# Altium schematic sheet EVB-ANNA-B5_SCHEM_0004_Connectors_Memory.SchDoc
size A3; Date: 7/24/2020; CompanyName: U-blox; DrawnBy: EMOO; Engineer: EMOO; Organization: U-blox; Address1: 3950 Fairview Industrial Dr SE #100*; Address2: Salem, OR 97302; DocumentNumber: 7; SheetNumber: 5; SheetTotal: 8; SheetSize: B; SheetTitle: Interface MCU
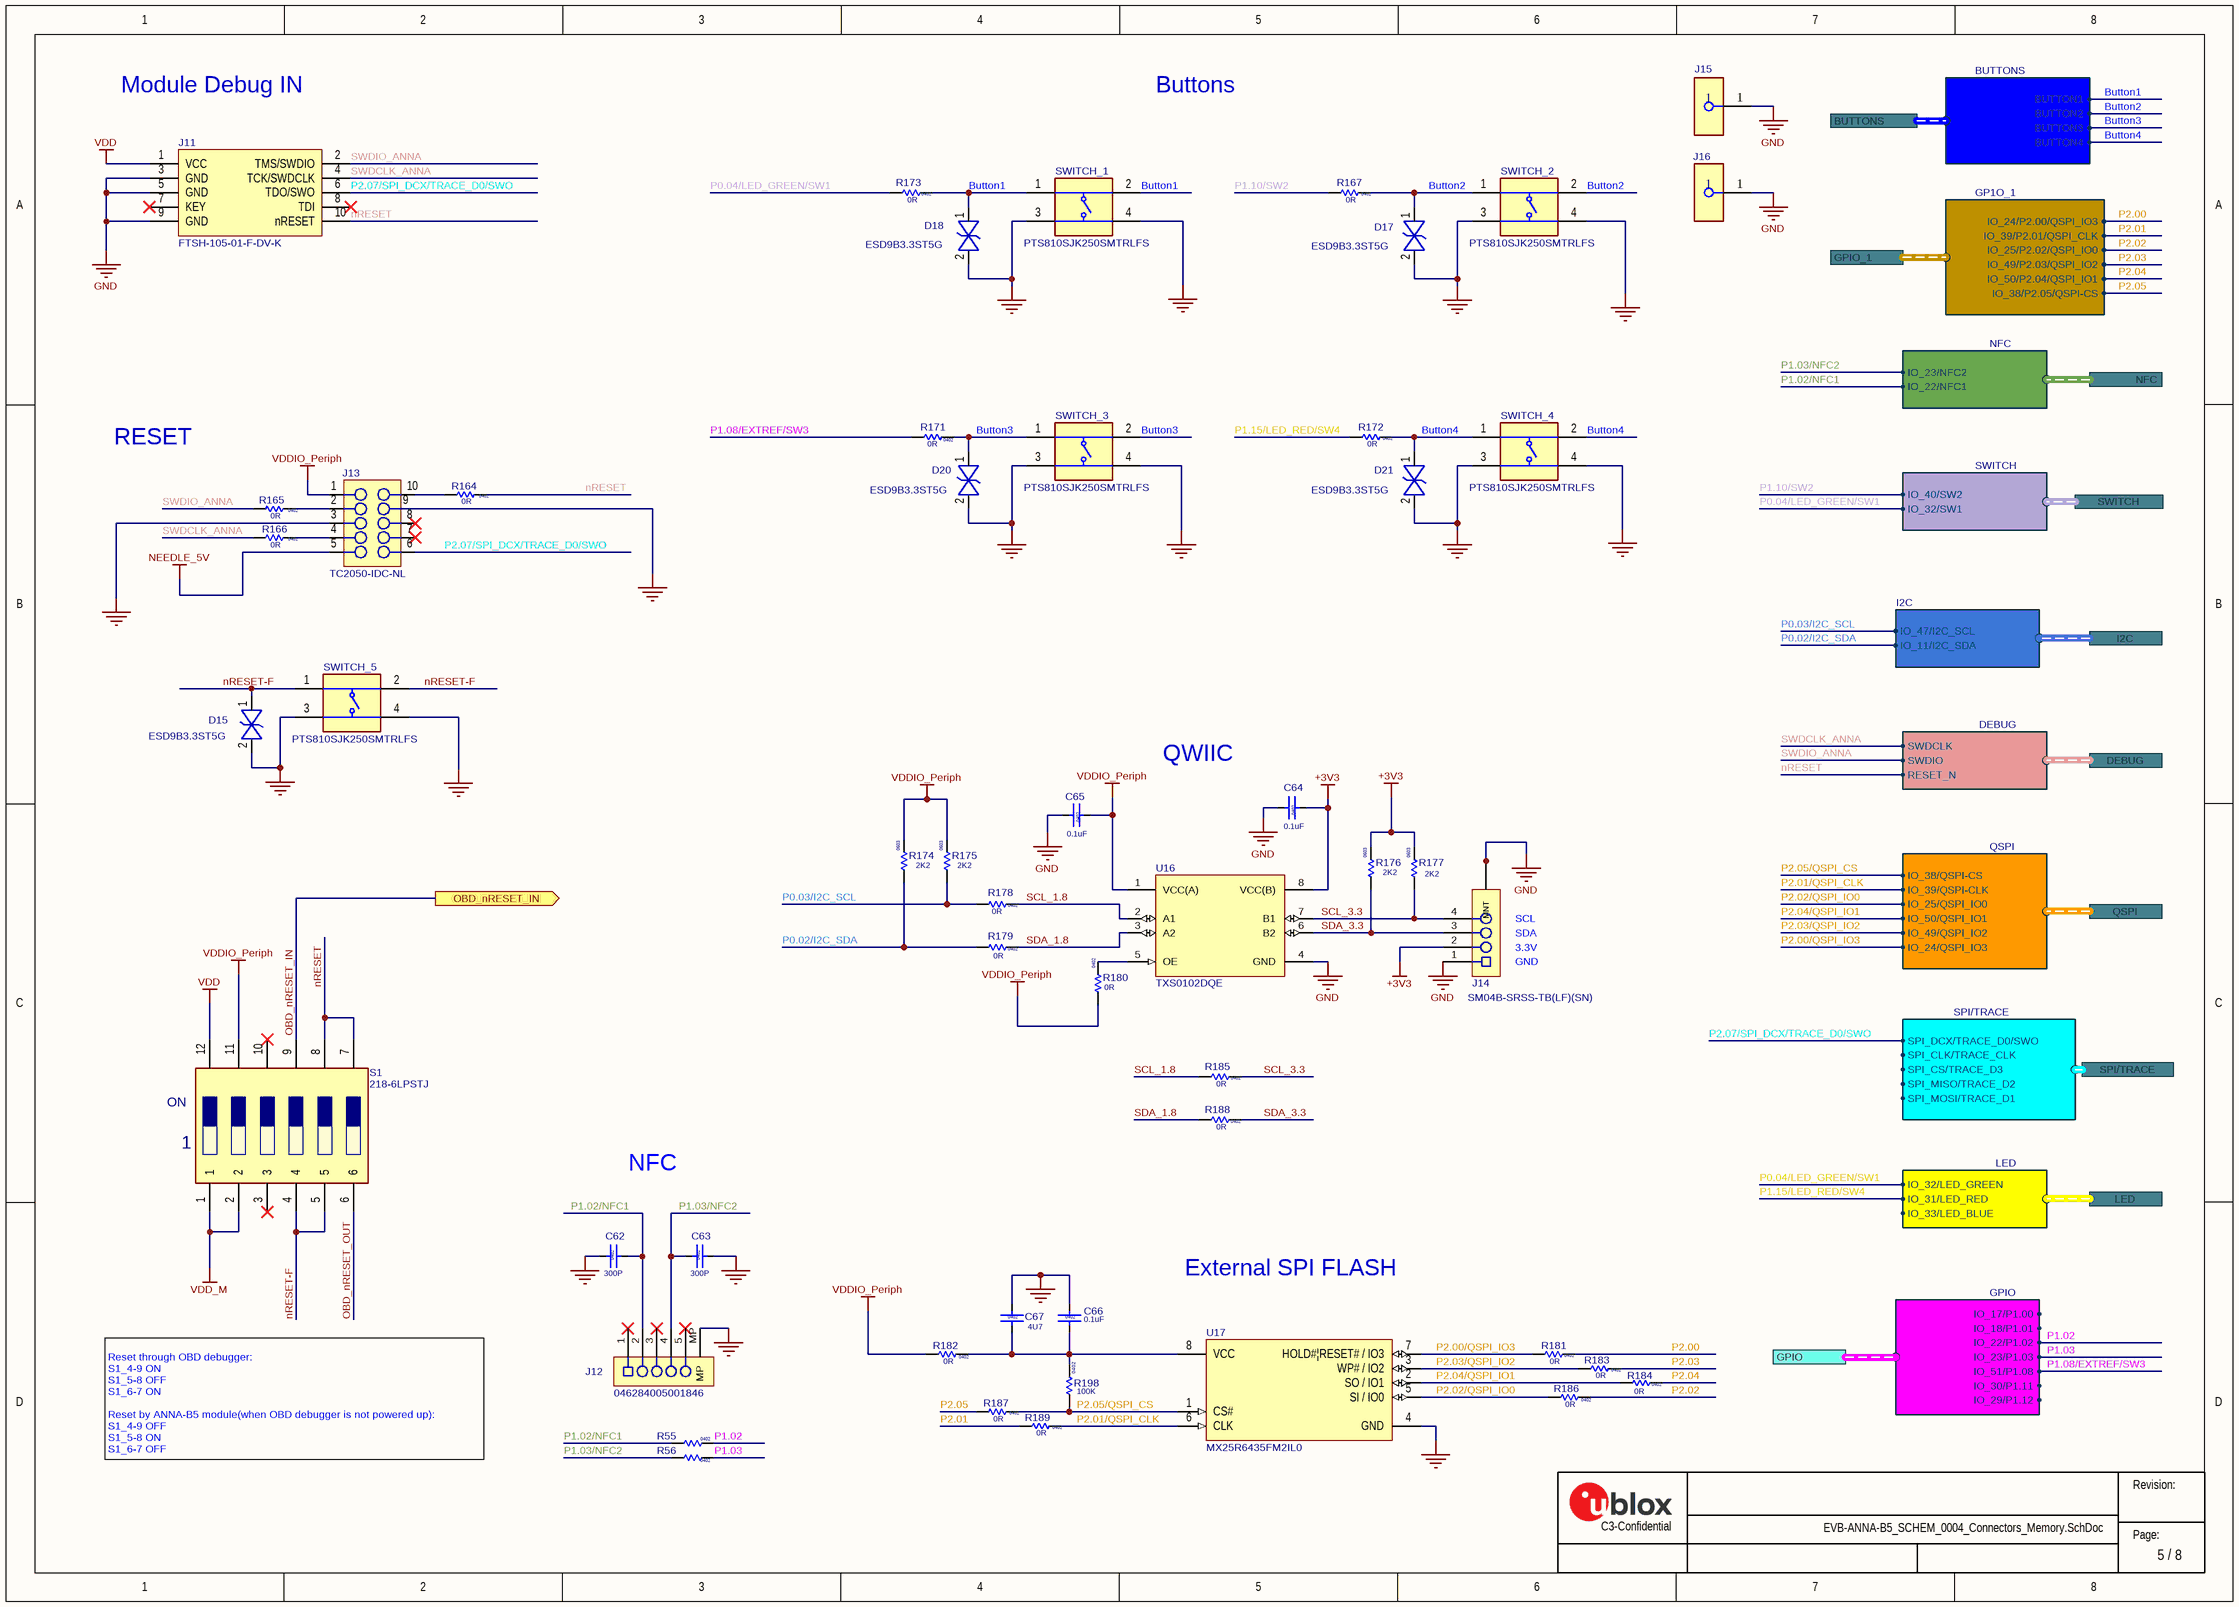
[diagram p0: EVB-ANNA-B5_SCHEM_0004_Connectors_Memory.SchDoc]

## Parts
C62  value 300P  Size: 0402  [Cap 0402 HD]  (hidden comment: UBXH01-0000594)
C63  value 300P  Size: 0402  [Cap 0402 HD]  (hidden comment: UBXH01-0000594)
C64  value 0.1uF  Size: 0402  [Cap 0402 HD]  (hidden comment: 120-00016)
C65  value 0.1uF  Size: 0402  [Cap 0402 HD]  (hidden comment: 120-00016)
C66  value 0.1uF  Size: 0402  [Cap 0402 HD]  (hidden comment: 120-00016)
C67  value 4U7  Size: 0402  [Cap 0402 HD]  (hidden comment: UBXH01-0000243)
D15  110-00019  [SOD-923]  (value not drawn)
D17  110-00019  [SOD-923]  (value not drawn)
D18  110-00019  [SOD-923]  (value not drawn)
D20  110-00019  [SOD-923]  (value not drawn)
D21  110-00019  [SOD-923]  (value not drawn)
J11  Manufacturer P/N: FTSH-105-01-F-DV-K  [HDR.050P-10Pin-2x5-SMT_Key]  (hidden comment: 130-00099)
J12  Manufacturer P/N: 046284005001846  [AVX/Kyocera - 046284005001846]  (hidden comment: UBXH04-0000798)
J13  TC2050-IDC-NL  [TC2050-IDC-NL]  (no BOM)
J14  Manufacturer Part Number 1: SM04B-SRSS-TB(LF)(SN)  [SM04B-SRSS-TB]  (hidden comment: UBXH04-0000797)
J15  (no value)  [Harwin_0_MFG]
J16  (no value)  [Harwin_0_MFG]
R55  Size: 0402  [RES 0402 HD]  (hidden comment: UBXH18-0003002)
R56  Size: 0402  [RES 0402 HD]  (hidden comment: UBXH18-0003002)
R164  value 0R  Size: 0402  [RES 0402 HD]  (hidden comment: UBXH18-0003002)
R165  value 0R  Size: 0402  [RES 0402 HD]  (hidden comment: UBXH18-0003002)
R166  value 0R  Size: 0402  [RES 0402 HD]  (hidden comment: UBXH18-0003002)
R167  value 0R  Size: 0402  [RES 0402 HD]  (hidden comment: UBXH18-0003002)
R171  value 0R  Size: 0402  [RES 0402 HD]  (hidden comment: UBXH18-0003002)
R172  value 0R  Size: 0402  [RES 0402 HD]  (hidden comment: UBXH18-0003002)
R173  value 0R  Size: 0402  [RES 0402 HD]  (hidden comment: UBXH18-0003002)
R174  value 2K2  Size: 0603  [RES_0603_1700Lx950Wx600H_600x1000Pad_800G_FLX]  (hidden comment: UBXH18-0007081)
R175  value 2K2  Size: 0603  [RES_0603_1700Lx950Wx600H_600x1000Pad_800G_FLX]  (hidden comment: UBXH18-0007081)
R176  value 2K2  Size: 0603  [RES_0603_1700Lx950Wx600H_600x1000Pad_800G_FLX]  (hidden comment: UBXH18-0007081)
R177  value 2K2  Size: 0603  [RES_0603_1700Lx950Wx600H_600x1000Pad_800G_FLX]  (hidden comment: UBXH18-0007081)
R178  value 0R  Size: 0402  [RES 0402 HD]  (hidden comment: UBXH18-0003002)
R179  value 0R  Size: 0402  [RES 0402 HD]  (hidden comment: UBXH18-0003002)
R180  value 0R  Size: 0402  [RES 0402 HD]  (hidden comment: UBXH18-0003002)
R181  value 0R  Size: 0402  [RES 0402 HD]  (hidden comment: UBXH18-0003002)
R182  value 0R  Size: 0402  [RES 0402 HD]  (hidden comment: UBXH18-0003002)
R183  value 0R  Size: 0402  [RES 0402 HD]  (hidden comment: UBXH18-0003002)
R184  value 0R  Size: 0402  [RES 0402 HD]  (hidden comment: UBXH18-0003002)
R185  value 0R  Size: 0402  [RES 0402 HD]  (hidden comment: UBXH18-0003002)
R186  value 0R  Size: 0402  [RES 0402 HD]  (hidden comment: UBXH18-0003002)
R187  value 0R  Size: 0402  [RES 0402 HD]  (hidden comment: UBXH18-0003002)
R188  value 0R  Size: 0402  [RES 0402 HD]  (hidden comment: UBXH18-0003002)
R189  value 0R  Size: 0402  [RES 0402 HD]  (hidden comment: UBXH18-0003002)
R198  value 100K  Size: 0402  [RES 0402 HD]  (hidden comment: UBXH18-0000005)
S1  218-6LPSTJ  [2186LPSTJ]
SWITCH_1  (no value)  [PTS810SJG250SMTRLFS]
SWITCH_2  (no value)  [PTS810SJG250SMTRLFS]
SWITCH_3  (no value)  [PTS810SJG250SMTRLFS]
SWITCH_4  (no value)  [PTS810SJG250SMTRLFS]
SWITCH_5  (no value)  [PTS810SJG250SMTRLFS]
U16  value TXS0102DQE  [DQE0008A]  (hidden comment: UBXH10-0000108)
U17  Manufacturer P/N: MX25R6435FM2IL0  [SOIC-8]  (hidden comment: UBXH13-0000149)

## Ports
BUTTONS (harness BUTTONS), DEBUG (harness Debug), GPIO (harness GPIO), GPIO_1 (harness GP1O_1), I2C (harness I2C), LED (harness LED), NFC (harness NFC), OBD_nRESET_IN (out), QSPI (harness QSPI), SPI/TRACE (harness SPI/TRACE), SWITCH (harness SWITCH)

## Harnesses
DEBUG: RESET_N, SWDIO, SWDCLK
SWITCH: IO_40/SW2, IO_32/SW1
LED: IO_33/LED_BLUE, IO_31/LED_RED, IO_32/LED_GREEN
BUTTONS: BUTTON3, BUTTON2, BUTTON1, BUTTON4
GP1O_1: IO_24/P2.00/QSPI_IO3, IO_39/P2.01/QSPI_CLK, IO_25/P2.02/QSPI_IO0, IO_49/P2.03/QSPI_IO2, IO_50/P2.04/QSPI_IO1, IO_38/P2.05/QSPI-CS
NFC: IO_23/NFC2, IO_22/NFC1
GPIO: IO_17/P1.00, IO_18/P1.01, IO_22/P1.02, IO_51/P1.08, IO_23/P1.03, IO_30/P1.11, IO_29/P1.12
SPI/TRACE: SPI_DCX/TRACE_D0/SWO, SPI_CLK/TRACE_CLK, SPI_CS/TRACE_D3, SPI_MISO/TRACE_D2, SPI_MOSI/TRACE_D1
QSPI: IO_38/QSPI-CS, IO_39/QSPI-CLK, IO_25/QSPI_IO0, IO_50/QSPI_IO1, IO_49/QSPI_IO2, IO_24/QSPI_IO3
I2C: IO_47/I2C_SCL, IO_11/I2C_SDA

## Nets
+3V3: C64.1 J14.2 R176.2 R177.2 U16.8(VCC(B))
GND: C62.1 C63.2 C64.2 C65.2 C66.1 C67.1 D15.2 D17.2 D18.2 D20.2 D21.2 J11.3(GND) J11.5(GND) J11.9(GND) J12.MP J13.3 J13.9 J14.1 J14.M1(MNT) J14.M2(MNT) J15.1 J16.1 SWITCH_1.3 SWITCH_1.4 SWITCH_2.3 SWITCH_2.4 SWITCH_3.3 SWITCH_3.4 SWITCH_4.3 SWITCH_4.4 SWITCH_5.3 SWITCH_5.4 U16.4(GND) U17.4(GND)
NEEDLE_5V: J13.5
VDD: J11.1(VCC) S1.12
VDD_M: S1.1 S1.2
VDDIO_Periph: C65.1 J13.1 R174.2 R175.2 R180.2 R182.1 S1.11 U16.1(VCC(A))
Button1: D18.1 R173.1 SWITCH_1.1 SWITCH_1.2 ; port BUTTONS.BUTTON1
Button2: D17.1 R167.1 SWITCH_2.1 SWITCH_2.2 ; port BUTTONS.BUTTON2
Button3: D20.1 R171.1 SWITCH_3.1 SWITCH_3.2 ; port BUTTONS.BUTTON3
Button4: D21.1 R172.1 SWITCH_4.1 SWITCH_4.2 ; port BUTTONS.BUTTON4
nRESET: J11.10(nRESET) R164.1 S1.7 S1.8 ; port DEBUG.RESET_N
nRESET-F: D15.1 S1.4 S1.5 SWITCH_5.1 SWITCH_5.2
OBD_nRESET_IN: S1.9 ; port OBD_nRESET_IN
OBD_nRESET_OUT: S1.6
P0.02/I2C_SDA: R174.1 R179.2 ; port I2C.IO_11/I2C_SDA
P0.03/I2C_SCL: R175.1 R178.2 ; port I2C.IO_47/I2C_SCL
P0.04/LED_GREEN/SW1: R173.2 ; port SWITCH.IO_32/SW1, port LED.IO_32/LED_GREEN
P1.02: R55.1 ; port GPIO.IO_22/P1.02
P1.02/NFC1: C62.2 J12.2 R55.2 ; port NFC.IO_22/NFC1
P1.03: R56.1 ; port GPIO.IO_23/P1.03
P1.03/NFC2: C63.1 J12.4 R56.2 ; port NFC.IO_23/NFC2
P1.08/EXTREF/SW3: R171.2 ; port GPIO.IO_51/P1.08
P1.10/SW2: R167.2 ; port SWITCH.IO_40/SW2
P1.15/LED_RED/SW4: R172.2 ; port LED.IO_31/LED_RED
P2.00: R181.1 ; port GPIO_1.IO_24/P2.00/QSPI_IO3
P2.00/QSPI_IO3: R181.2 U17.7(HOLD#|RESET#_/_IO3) ; port QSPI.IO_24/QSPI_IO3
P2.01: R189.2 ; port GPIO_1.IO_39/P2.01/QSPI_CLK
P2.01/QSPI_CLK: R189.1 U17.6(CLK) ; port QSPI.IO_39/QSPI-CLK
P2.02: R186.1 ; port GPIO_1.IO_25/P2.02/QSPI_IO0
P2.02/QSPI_IO0: R186.2 U17.5(SI_/_IO0) ; port QSPI.IO_25/QSPI_IO0
P2.03: R183.1 ; port GPIO_1.IO_49/P2.03/QSPI_IO2
P2.03/QSPI_IO2: R183.2 U17.3(WP#_/_IO2) ; port QSPI.IO_49/QSPI_IO2
P2.04: R184.1 ; port GPIO_1.IO_50/P2.04/QSPI_IO1
P2.04/QSPI_IO1: R184.2 U17.2(SO_/_IO1) ; port QSPI.IO_50/QSPI_IO1
P2.05: R187.2 ; port GPIO_1.IO_38/P2.05/QSPI-CS
P2.05/QSPI_CS: R187.1 R198.2 U17.1(CS#) ; port QSPI.IO_38/QSPI-CS
P2.07/SPI_DCX/TRACE_D0/SWO: J11.6(TDO/SWO) J13.6 ; port SPI/TRACE.SPI_DCX/TRACE_D0/SWO
SCL_1.8: R178.1 R185.2 U16.2(A1)
SCL_3.3: J14.4 R177.1 R185.1 U16.7(B1)
SDA_1.8: R179.1 R188.2 U16.3(A2)
SDA_3.3: J14.3 R176.1 R188.1 U16.6(B2)
SWDCLK_ANNA: J11.4(TCK/SWDCLK) R166.2 ; port DEBUG.SWDCLK
SWDIO_ANNA: J11.2(TMS/SWDIO) R165.2 ; port DEBUG.SWDIO
NetC66_2: C66.2 C67.2 R182.2 R198.1 U17.8(VCC)
NetJ13_2: J13.2 R165.1
NetJ13_4: J13.4 R166.1
NetJ13_10: J13.10 R164.2
NetR180_1: R180.1 U16.5(OE)

Not connected (* = marked no-connect by the designer): J11 7(KEY)* 8(TDI)*; J12 1* 3* 5*; J13 7* 8*; S1 3* 10*

## Notes on the sheet
- Module Debug IN
- Buttons
- RESET
- QWIIC
- (near J14) SCL
- (near J14) SDA
- (near J14) GND
- (near J14) 3.3V
- NFC
- External SPI FLASH
- Reset through OBD debugger:
  S1_4-9 ON
  S1_5-8 OFF
  S1_6-7 ON
  Reset by ANNA-B5 module(when OBD debugger is not powered up):
  S1_4-9 OFF
  S1_5-8 ON
  S1_6-7 OFF
- Revision:
- C3-Confidential
- Page:
- (in symbol 218-6LPSTJ) ON

## Library data of the parts
C62 C63 = UBXH01-0000594: CAP CER C0G 0402 300P 50V; Manufacturer: Murata Manufacturing Company, Ltd.; Manufacturer P/N: GRM1555C1H301JA01D; Editor: eric.moog; Env: ROHS; Permitted Use: Volume Products; Perferred: PREF; Mfg P/N Status: Active; Mfg P/N Split: 100; Mfg P/N Released: No; Part Number: UBXH01-0000594; Max Voltage: 50V; Min Operating Temp: -55°C; Max Operating Temp: 125°C; Part Type: Capacitor; UBX Wiki: https://wiki.u-blox.com/bin/view/Operations/PartDetails?index=38856; RefDes: C
C64-C66 = 120-00016: Cap, Ceramic 0.1uF 10V 10% X5R 0402; Part Name: CAP CER 0.1UF 10V 10% X5R 0402; Part_Type: Ceramic Capacitor; Manufacturer: Murata Electronics North America; Manufacturer P/N: GRM155R61A104KA01J; Item_Phase: Production; Component Mounting Type: SMT; Tolerance: +/- 10%; Use in new designs: Yes; Part Number: 120-00016; Revision: 0A; Supplier 1: Digi-Key; Supplier Part Number 1: 490-6297-1-ND; Manufacturer 2: Yageo; Manufacturer P/N 2: CC0402KRX5R6BB104; Supplier 2: Digi-Key; Supplier Part Number 2: 311-1336-1-ND; Arena Link: https://app.bom.com/a/GYHPV2L2L43KRMBK?v=spec.summary; Height: 0.55mm; Pins: 2; Temperature Coefficient: X5R; Voltage: 10V
C67 = UBXH01-0000243: CAP CER X5R 0402 4U7 20% 10V; Manufacturer: Murata Manufacturing Company, Ltd.; Manufacturer P/N: GRM155R61A475MEAA; Editor: martin.pilik; Released by: fabrice.bret-dibat; Env: GREEN; Permitted Use: Volume Products; Perferred: PREF; Mfg P/N Status: Active; Mfg P/N Split: 100; Mfg P/N Released: Yes; Part Number: UBXH01-0000243; Tolerance: 20%; Max Voltage: 10V; Min Operating Temp: -40°C; Max Operating Temp: 85°C; Part Type: Capacitor; Release Data: 2021-05-10 12:57:47.325652; UBX Wiki: https://wiki.u-blox.com/bin/view/Operations/PartDetails?index=24303; RefDes: C; Mfg P/N Datasheet: https://wiki.u-blox.com/bin/view/Generic/Docs/DocumentSummary?index=24302
D15 D17 D18 D20 D21 = 110-00019: ESD9B3.3ST5G; Part Name: Diode TVS 3.3V SOD-923; Part_Type: Diode; Manufacturer: ON Semiconductor; Item_Phase: Preliminary; Body Size: 0.8mm x 0.6mm; Component Mounting Type: SMT; Diode Type: TVS; Use in new designs: Yes; Voltage: 3.3V; Part Number: 110-00019; Manufacturer P/N: ESD9B3.3ST5G; Supplier 1: Digi-Key; Supplier Part Number 1: ESD9B3.3ST5GOSCT-ND; Arena Link: https://app.bom.com/a/4M5DJQ9Q9SR7DV4H?v=spec.summary; Height: 0.4mm; MFG Package: SOD-923; Package Type: SOD; Pins: 2
J11 = 130-00099: Header 0.05" 10Pin 2Row SMD Black; Part Name: CON HDR 0.05" 10Pin 2Row SMD Black; Part_Type: Connector; Manufacturer: Samtec; Item_Phase: Pre-Production; Component Mounting Type: SMT; Keyed: Yes; Locking: No; Pin Pitch: 0.050"; Rows: 2; Part Number: 130-00099; Revision: 1; Supplier 1: Digi-Key; Supplier Part Number 1: SAM8796-ND; Arena Link: https://app.bom.com/a/5N6EKRARATS7TSHL?v=spec.summary; Color: Black; Connector Type: Header; Height: 6mm; Length: 12.75mm; Pins: 10; Use in new designs: Yes; Width: 4.78
J12 = UBXH04-0000798: 0.50MM PITCH SMD RA FFC FPC CONN 5 -PIN 50V 400mA; Part Name: CON FFC/FPC 0.50mm 5Pos R/A; Part_Type: Connector; Manufacturer 1: KYOCERA AVX; Manufacturer: AVX; Item_Phase: Preliminary; Component Mounting Type: SMT; Keyed: No; Pin Pitch: 0.5mm; Rows: 1; Use in new designs: Yes; Value: 046284005001846; Editor: eric.moog; Env: ROHS; Permitted Use: Support Products; Perferred: PREF; Mfg P/N Status: Active; Mfg P/N Split: 100; Part Number: UBXH04-0000798; Color: White; Connector Type: FPC; Height: 1.3mm; Length: 4.05mm; Locking: No; Pins: 5; Voltage: 50V; Width: 4.4mm; Manufacturer Part Number 1: 046284005001846; Max Voltage: 50V; Max Current: 400mA; Min Operating Temp: -40°C; Max Operating Temp: 85°C; Part Type: Connector; UBX Wiki: https://wiki.u-blox.com/bin/view/Operations/PartDetails?index=38822; RefDes: J; Mfg P/N Released: No; Mfg P/N Datasheet: https://wiki.u-blox.com/bin/view/Generic/Docs/DocumentSummary?index=38862
J13 = TC2050-IDC-NL: CON PADS FOR CBL PLUG-OF-NAILS 10-PIN NO LEGS; Manufacturer: TAG Connect; Added By: Paul B; Manufacturer P/N: TC2050-IDC-NL; Part Number: TC2050-IDC-NL; Size: 6.1mm x 9.9mm; Height: 0; DNP: DNP; Added Date: 12/3/2015
J14 = UBXH04-0000797: CONN JST SH SERIES SMT 4 POS MALE 1MM RA 50V 1A; Manufacturer 1: JST Sales America Inc.; Part Name: CONN HEADER SMD R/A 4POS 1MM; Item Phase: In Production; Use in new designs: Yes; Voltage: None; Value: SM04B-SRSS-TB; Editor: eric.moog; Env: ROHS; Permitted Use: Support Products; Perferred: PREF; Mfg P/N Status: Active; Mfg P/N Split: 100; Mfg P/N Released: No; Part Number: UBXH04-0000797; Supplier 1: None; Supplier Part Number 1: None; Diameter: None; Height: 2.9mm; Max Operating Temp: 85°C; Min Operating Temp: -30°C; Pins: 4; Revision: 0A; UBX Code: None; Manufacturer 2: None; Manufacturer Part Number 2: None; Supplier 2: None; Supplier Part Number 2: None; Manufacturer P/N: SM04B-SRSS-TB; Max Voltage: 50V; Max Current: 1A; Part Type: Connector; UBX Wiki: https://wiki.u-blox.com/bin/view/Operations/PartDetails?index=38779; RefDes: J; Manufacturer: JST; Mfg P/N Datasheet: https://wiki.u-blox.com/bin/view/Generic/Docs/DocumentSummary?index=4533
J15 J16 = S1751-46R
R55 R56 R164-R167 R171-R173 R178-R181 R183-R189 = UBXH18-0003002: RES THICK FILM CHIP 0402 0R 0 100mW; Manufacturer: KOA; Manufacturer P/N: RK73Z1ETTP; Tolerance: 0; Editor: charlotte.biber; Released by: peter.mueller; Env: ROHS; Permitted Use: Volume Products; Perferred: PREF; Mfg P/N Status: NRND; Mfg P/N Split: 100; Mfg P/N Released: Yes; Part Number: UBXH18-0003002; Max Power: 100mW; Part Type: Resistor; Release Data: 2012-06-05 09:49:55.978616; UBX Wiki: https://wiki.u-blox.com/bin/view/Operations/PartDetails?index=6611; RefDes: R; Manufacturer 2: YAGEO; Manufacturer P/N 2: 2322_705_91001_L; Mfg P/N Status 2: NRND; Mfg P/N Split 2: 0; Mfg P/N Released 2: Yes
  R55 R56: Value: 0R
R174-R177 = UBXH18-0007081: RES THICK FILM CHIP 0603 2K2 5% 100mW; Manufacturer: YAGEO; Manufacturer P/N: 2322_702_81222_L; Editor: roland.rust; Env: ROHS; Permitted Use: Volume Products; Perferred: PREF; Mfg P/N Status: Obsolete; Mfg P/N Split: 100; Mfg P/N Released: Yes; Part Number: UBXH18-0007081; Tolerance: 5%; Max Power: 100mW; Part Type: Resistor; Released by: roland.rust; Release Data: 2007-04-26T15:06:13; UBX Wiki: https://wiki.u-blox.com/bin/view/Operations/PartDetails?index=6711; RefDes: R; Manufacturer 2: YAGEO; Manufacturer P/N 2: RC0603JR-072K2L; Mfg P/N Status 2: Active; Mfg P/N Split 2: 0; Mfg P/N Released 2: Yes; Mfg P/N Datasheet 2: https://wiki.u-blox.com/bin/view/Generic/Docs/DocumentSummary?index=8241
R182 = UBXH18-0003002: RES THICK FILM CHIP 0402 0R 0 100mW; Manufacturer: KOA; Manufacturer P/N: RK73Z1ETTD; Tolerance: 0; Editor: charlotte.biber; Released by: peter.mueller; Env: ROHS; Permitted Use: Volume Products; Perferred: PREF; Mfg P/N Status: NRND; Mfg P/N Split: 100; Mfg P/N Released: Yes; Part Number: UBXH18-0003002; Max Power: 100mW; Part Type: Resistor; Release Data: 2012-06-05 09:49:55.978616; UBX Wiki: https://wiki.u-blox.com/bin/view/Operations/PartDetails?index=6611; RefDes: R; Manufacturer 2: YAGEO; Manufacturer P/N 2: 2322_705_91001_L; Mfg P/N Status 2: NRND; Mfg P/N Split 2: 0; Mfg P/N Released 2: Yes
R198 = UBXH18-0000005: RES THICK FILM CHIP 0402 100K 1% 63mW; Manufacturer: KOA; Manufacturer P/N: RK73H1ETTP1003F; Editor: dario.antonaz; Released by: sandro.sestan; Env: ROHS; Permitted Use: Volume Products; Mfg P/N Status: Active; Mfg P/N Split: 100; Mfg P/N Released: Yes; Part Number: UBXH18-0000005; Tolerance: 1%; Max Power: 63mW; Part Type: Resistor; Release Data: 2009-11-30T11:05:22; UBX Wiki: https://wiki.u-blox.com/bin/view/Operations/PartDetails?index=8114; Perferred: N/A; RefDes: R; Manufacturer 2: YAGEO; Manufacturer P/N 2: RC0402FR-07100KL; Mfg P/N Status 2: Active; Mfg P/N Split 2: 0; Mfg P/N Released 2: Yes; Case/Package: 0x0y; Mfg P/N Datasheet: https://wiki.u-blox.com/bin/view/Generic/Docs/DocumentSummary?index=8222; Mfg P/N Datasheet 2: https://wiki.u-blox.com/bin/view/Generic/Docs/DocumentSummary?index=29373; Manufacturer 3: ROHM; Manufacturer P/N 3: MCR01MZPF1003; Mfg P/N Status 3: Obsolete; Mfg P/N Split 3: 0; Mfg P/N Released 3: Yes; Mfg P/N Datasheet 3: https://wiki.u-blox.com/bin/view/Generic/Docs/DocumentSummary?index=8186
S1 = 218-6LPSTJ: Switch; Manufacturer_Name: CTS; Datasheet Link: https://www.ctscorp.com/wp-content/uploads/218.pdf; Height: 2.7mm; Manufacturer_Part_Number: 218-6LPSTJ; Mouser Part Number: 774-2186LPSTJ; Mouser Price/Stock: https://www.mouser.co.uk/ProductDetail/CTS-Electronic-Components/218-6LPSTJ?qs=hDoPxpGr7lflvoQJzlrOfA%3D%3D; Arrow Part Number: 218-6LPSTJ; Arrow Price/Stock: https://www.arrow.com/en/products/218-6lpstj/cts
SWITCH_1-SWITCH_5 = PTS810SJK250SMTRLFS: Switch; Manufacturer_Name: C & K COMPONENTS; Datasheet Link: https://www.ckswitches.com/media/1476/pts810.pdf; Manufacturer_Part_Number: PTS810SJK250SMTRLFS; Mouser Part Number: 611-PTS810SJK250SMTR; Mouser Price/Stock: https://www.mouser.co.uk/ProductDetail/CK/PTS810SJK250SMTRLFS?qs=UxeAxwACbqlfHzoZSrW3%2Fw%3D%3D
U16 = UBXH10-0000108: TXS0102 2-BIT BIDIRECTIONAL VOLTAGE-LEVEL TRANSLATOR X2SON-8 TXS0102DQE 5.5V; Manufacturer 1: Texas Instruments; Manufacturer Part Number 1: TXS0102DQET; Body Size: 1.9mm x 0.9mm; Current: None; Item Phase: In Production; MFG Package: DSBGA-8; Use in new designs: Yes; Editor: eric.moog; Env: ROHS; Permitted Use: Support Products; Perferred: PREF; Mfg P/N Status: Active; Mfg P/N Split: 100; Mfg P/N Released: No; Part Number: UBXH10-0000108; Manufacturer 2: Texas Instruments; Manufacturer Part Number 2: TXS0102DQER; Height: 0.65mm; Max Operating Temp: 85°C; Min Operating Temp: -40°C; Part Name: TXS0102DQE; Pins: 8; Revision: 0A; Voltage: N/A; UBX Code: None; Max Voltage: 5.5V; Part Type: Interface; Single Source: Yes; UBX Wiki: https://wiki.u-blox.com/bin/view/Operations/PartDetails?index=39049; RefDes: U; Manufacturer: Texas Instruments; Manufacturer P/N: TXS0102DQE; Mfg P/N Datasheet: https://wiki.u-blox.com/bin/view/Generic/Docs/DocumentSummary?index=22177
U17 = UBXH13-0000149: MACRONIX MX25R6435FM2IL0 64MBIT SERIAL QUAD I/O SPI FLASH MEMORY 1.65 - 3.6V 8-SOP (200mil); Part Phase: Unreleased; Part Revision: 1; Manufacturer 1: Macronix International Co.,Ltd.; Manufacturer Split 1: 100; Use in new designs: Yes; Environmental Grade: RoHS; Owner: Hozaifa Abdelgadir; Volume Use: No; Body Size: 5.38mm x 5.33mm; Interface: QSPI; Max Supply Voltage: 3.6; Memory Size: 64MB; Memory Speed: 80MHz; Memory Type: NOR FLASH; Min Supply Voltage: 1.65; SMT Pitch: 1.27mm; Part Number: UBXH13-0000149; Max Operating Temp: 85°C; Min Operating Temp: -40°C; Part Name: MACRONIX MX25R6435FM2IL0 64MBIT SERIAL QUAD I/O SPI FLASH MEMORY 1.65 - 3.6V 8-SOP (200mil); Automotive: No; ComponentLink1Description: Arena Link; ComponentLink1Url: https://app.bom.com/7P9SXLTVPRAI1EPKZK38; Part Status: Preferred; Part Type: Memory; Manufacturer Part Number 1: MX25R6435FM2IL0; Single Source: No; Height: 2.16; Mounting Type: SMT; Pins: 8; Thermal Pad: No; Case/Package: 8-SOP